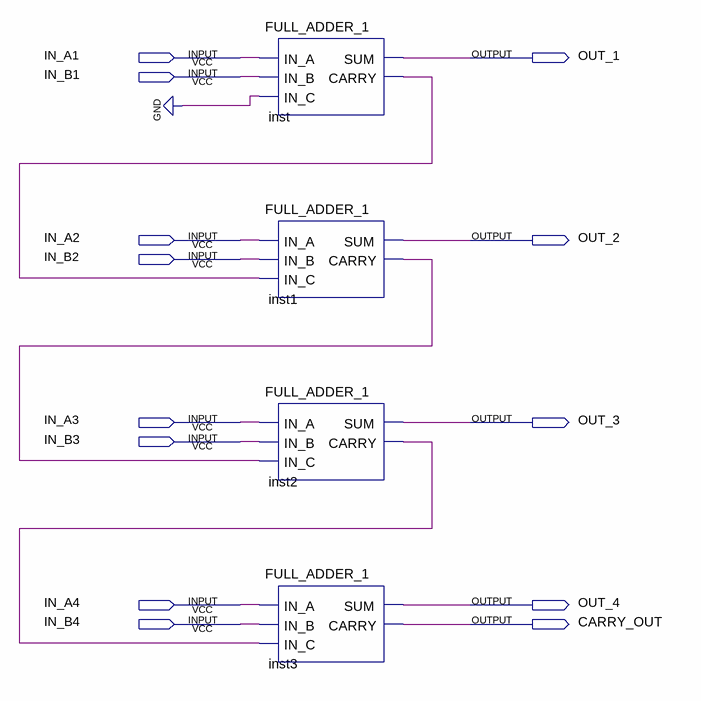
[diagram p0: schematic sheet]
// Quartus schematic ADDITION.bdf as structural Verilog: 4 symbols, 13 pins
module ADDITION (
  input  IN_A1,
  input  IN_B1,
  input  IN_A2,
  input  IN_B2,
  input  IN_A3,
  input  IN_B3,
  input  IN_A4,
  input  IN_B4,
  output OUT_1,
  output OUT_2,
  output OUT_3,
  output OUT_4,
  output CARRY_OUT
);

  wire inst1_carry, inst2_carry, inst_carry;

  FULL_ADDER_1 inst (.IN_A(IN_A1), .IN_B(IN_B1), .IN_C(1'b0), .SUM(OUT_1), .CARRY(inst_carry));
  FULL_ADDER_1 inst1 (.IN_A(IN_A2), .IN_B(IN_B2), .IN_C(inst_carry), .SUM(OUT_2), .CARRY(inst1_carry));
  FULL_ADDER_1 inst2 (.IN_A(IN_A3), .IN_B(IN_B3), .IN_C(inst1_carry), .SUM(OUT_3), .CARRY(inst2_carry));
  FULL_ADDER_1 inst3 (.IN_A(IN_A4), .IN_B(IN_B4), .IN_C(inst2_carry), .SUM(OUT_4), .CARRY(CARRY_OUT));
endmodule
